# EAGLE design glove-unit (EAGLE 9.6.2)

## Sheet 1 of 2: ESP8266 LOLIN MCU
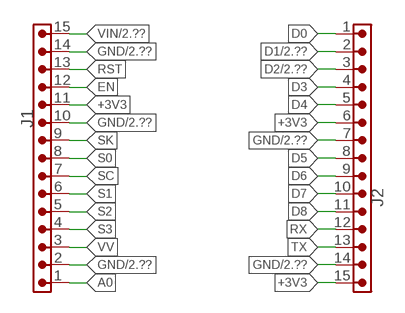
[diagram p0: schematic, sheet 1]

### Parts
J1  6130XX11121_61301511121  [61301511121]
J2  6130XX11121_61301511121  [61301511121]

### Nets
+3V3: J1.11 J2.6 J2.15 ; also sheet 2
A0: J1.1
D0: J2.1
D1: J2.2 ; also sheet 2
D2: J2.3 ; also sheet 2
D3: J2.4
D4: J2.5
D5: J2.8
D6: J2.9
D7: J2.10
D8: J2.11
EN: J1.12
GND: J1.2 J1.10 J1.14 J2.7 J2.14 ; also sheet 2
RST: J1.13
RX: J2.12
S0: J1.8
S1: J1.6
S2: J1.5
S3: J1.4
SC: J1.7
SK: J1.9
TX: J2.13
VIN: J1.15 ; also sheet 2
VV: J1.3

## Sheet 2 of 2: Connections
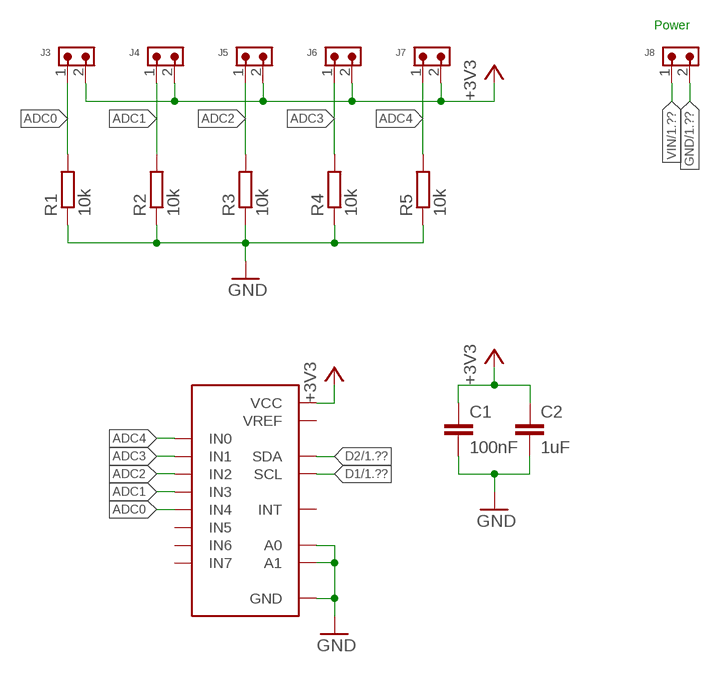
[diagram p1: schematic, sheet 2]

### Parts
C1  100nF  CC0603  [C0603]
C2  1uF  CC0603  [C0603]
J3  6130XX11121_61300211121  [61300211121]
J4  6130XX11121_61300211121  [61300211121]
J5  6130XX11121_61300211121  [61300211121]
J6  6130XX11121_61300211121  [61300211121]
J7  6130XX11121_61300211121  [61300211121]
J8  6130XX11121_61300211121  [61300211121]
R1  10k  R  [R0805]
R2  10k  R  [R0805]
R3  10k  R  [R0805]
R4  10k  R  [R0805]
R5  10k  R  [R0805]
U$1  ADC128D818  [TSSOP-16]

### Nets
+3V3: C1.1 C2.1 J3.2 J4.2 J5.2 J6.2 J7.2 U$1.5(VCC) ; also sheet 1
ADC0: J3.1 R1.2 U$1.12(IN4)
ADC1: J4.1 R2.2 U$1.13(IN3)
ADC2: J5.1 R3.2 U$1.14(IN2)
ADC3: J6.1 R4.2 U$1.15(IN1)
ADC4: J7.1 R5.2 U$1.16(IN0)
D1: U$1.3(SCL) ; also sheet 1
D2: U$1.2(SDA) ; also sheet 1
GND: C1.2 C2.2 J8.2 R1.1 R2.1 R3.1 R4.1 R5.1 U$1.4(GND) U$1.7(A0) U$1.8(A1) ; also sheet 1
VIN: J8.1 ; also sheet 1
Unconnected: U$1.1(VREF) U$1.6(INT) U$1.9(IN7) U$1.10(IN6) U$1.11(IN5)

### Notes on the sheet
- Power

## Library data of the parts
C1 C2 = ACS - Basics:C: CAPACITOR, European symbol; SPICEMODEL: NONE; SPICEPREFIX: C
J1 J2 = Wurth_Connectors_WR-PHD:6130XX11121_61301511121: WR-PHD 2.54 mm THT Pin Header ARTICLE PROPERTIES: Pins:1;​ 2;​ 3;​ 4;​ 5;​ 6;​ 7;​ 8;​ 9;​ 10;​ 12;​ 13;​ 14;​ 15;​ 16;​ 18;​ 20;​ 22;​ 24;​ 25;​ 32;​ 36;​ 40 KIND PROPERTIES: Pitch：2.54 mm Quality Class:3 as per CECC 75 301-802 Rows：Single Gender：Pin Header Type：Straight MATERIAL PROPERTIES: Insulator Material :PBT Insulator Flammability Rating:UL94 V-0 Contact Material:Copper Alloy Contact Plating:Gold Contact Type:Stamped GENERAL INFORMATION Operating Temperature:-40 up to +105 °C Compliance:RoHS ELECTRICAL PROPERTIES: Rated Current:3 A IR 1:3 A Withstanding Voltage:500 V (AC) Contact Resistance:20 mΩ RISO:1000 MΩ CERTIFICATION UL Approval:E323964 PACKAGING PROPERTIES Packaging:Bag <https://katalog.we-online.com/media/images/v2/o33211v209%20Family_BTB_PHD_6130xx11121.jpg> Details see: https://katalog.we-online.com/en/em/PHD_2_54_THT_PIN_HEADER_6130XX11121 Updated by Yingchun,Shan 2019-10-16 2019 (C) Würth Elektronik; DATASHEET-URL: https://katalog.we-online.com/em/datasheet/61301511121.pdf; GENDER: Pin Header; IR: 3A; MATES: WR-PHD 2.54mm Angled Socket Header /SMT Socket Header/Socket Header; PACKAGING: Bag; PART-NUMBER: 61301511121; PINS: 15; ROWS: Single; TYPE: Straight
J3-J8 = Wurth_Connectors_WR-PHD:6130XX11121_61300211121: WR-PHD 2.54 mm THT Pin Header ARTICLE PROPERTIES: Pins:1;​ 2;​ 3;​ 4;​ 5;​ 6;​ 7;​ 8;​ 9;​ 10;​ 12;​ 13;​ 14;​ 15;​ 16;​ 18;​ 20;​ 22;​ 24;​ 25;​ 32;​ 36;​ 40 KIND PROPERTIES: Pitch：2.54 mm Quality Class:3 as per CECC 75 301-802 Rows：Single Gender：Pin Header Type：Straight MATERIAL PROPERTIES: Insulator Material :PBT Insulator Flammability Rating:UL94 V-0 Contact Material:Copper Alloy Contact Plating:Gold Contact Type:Stamped GENERAL INFORMATION Operating Temperature:-40 up to +105 °C Compliance:RoHS ELECTRICAL PROPERTIES: Rated Current:3 A IR 1:3 A Withstanding Voltage:500 V (AC) Contact Resistance:20 mΩ RISO:1000 MΩ CERTIFICATION UL Approval:E323964 PACKAGING PROPERTIES Packaging:Bag <https://katalog.we-online.com/media/images/v2/o33211v209%20Family_BTB_PHD_6130xx11121.jpg> Details see: https://katalog.we-online.com/en/em/PHD_2_54_THT_PIN_HEADER_6130XX11121 Updated by Yingchun,Shan 2019-10-16 2019 (C) Würth Elektronik; DATASHEET-URL: https://katalog.we-online.com/em/datasheet/61300211121.pdf; GENDER: Pin Header; IR: 3A; MATES: WR-PHD 2.54mm Angled Socket Header /SMT Socket Header/Socket Header; PACKAGING: Bag; PART-NUMBER: 61300211121; PINS: 2; ROWS: Single; TYPE: Straight
R1-R5 = ACS - Basics:R: RESISTOR, European symbol; SPICEMODEL: NONE; SPICEPREFIX: R
U$1 = ACS - Chips:ADC128D818

## Board
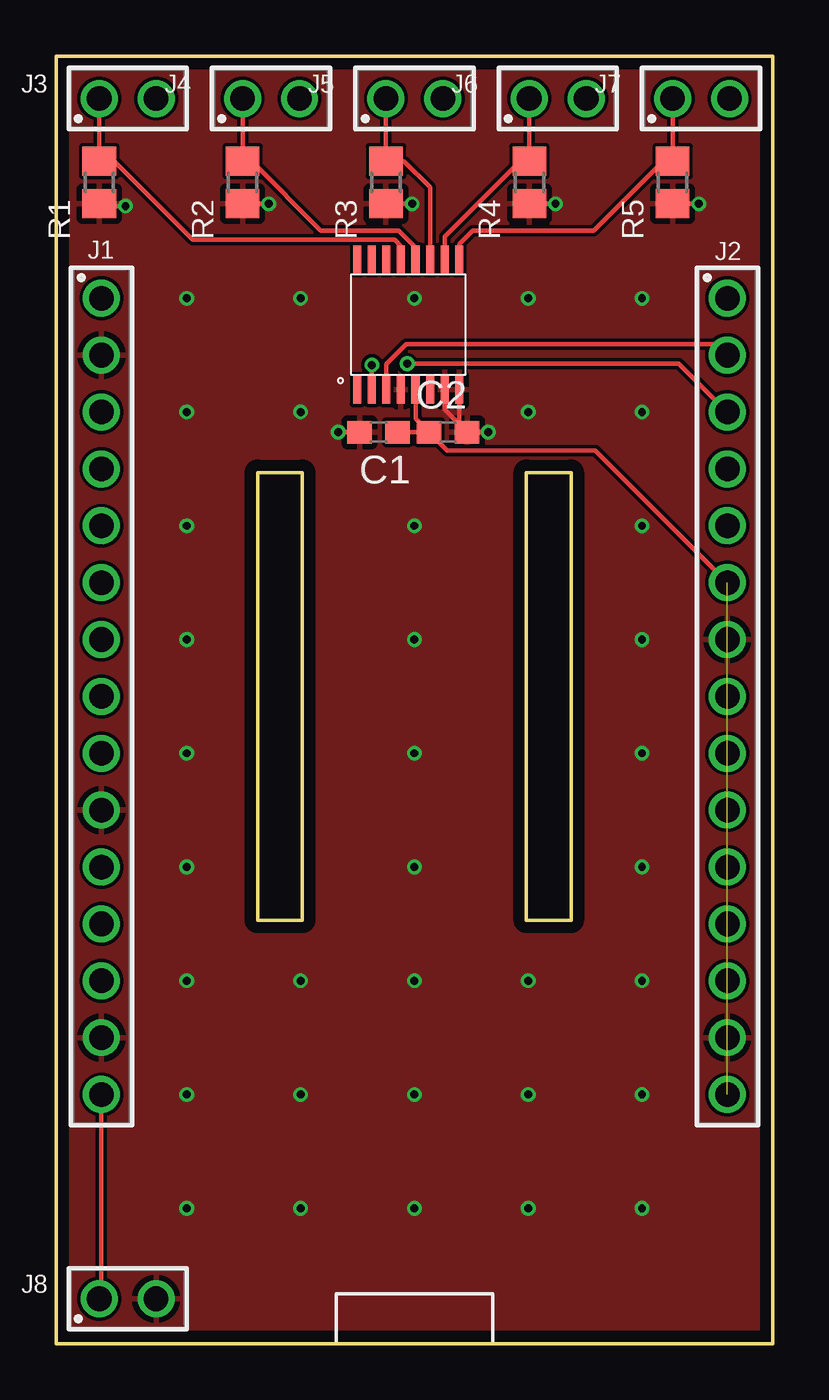
[diagram p2: board, top side]
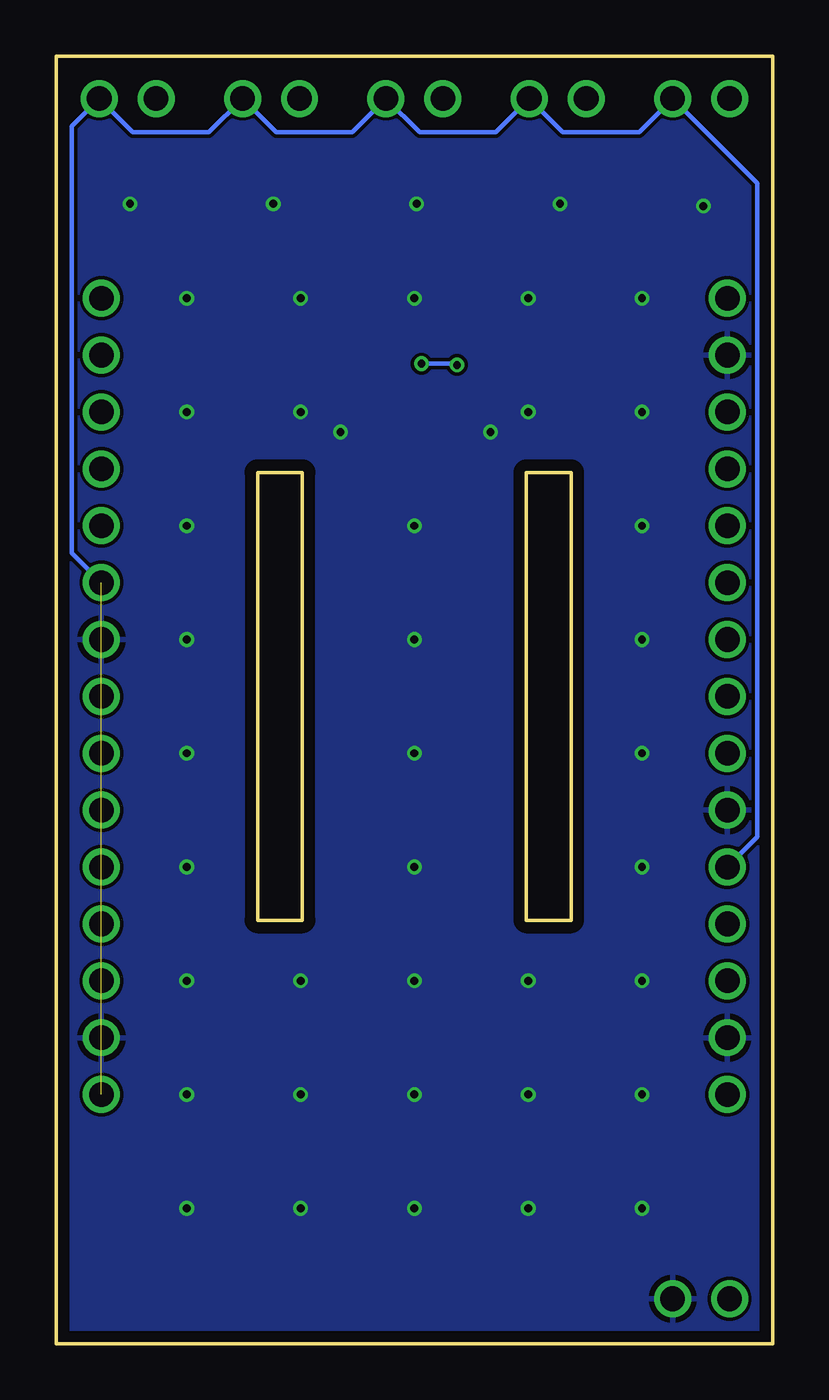
[diagram p3: board, bottom side, seen from below]

Size 32 x 57.5 mm. Coordinates in mm from the lower left corner, seen from the top.
Outline: 0,0 0,57.5 32,57.5 32,0 0,0
Outline: 9,18.9 9,38.9 11,38.9 11,18.9 9,18.9
Outline: 21,18.9 21,38.9 23,38.9 23,18.9 21,18.9
Copper layers (1*16): Top 0.035mm / dielectric 1.6mm / Bottom 0.035mm
Design rules "Elecrow_2-layer_PCB_eagle_rule": minimum track width 6mil, minimum drill 12mil, track to track 6mil, track to pad 6mil, pad to pad 6mil, via to via 8mil, smd to smd 0mil, copper to edge 20mil, drill to drill 10mil, minimum pad ring 6mil, minimum via ring 6mil, stop-mask expansion 0mil, vias tented up to drill 100mil, thermal gap 10mil

### Footprints (pad centres in the part's own frame; a part is rotated, then mirrored left to right if it is on the bottom)
C0603 = smd 1.1 x 1: 1 -0.85,0; 2 0.85,0
61301511121 = drill 1.1: 1 -17.78,0; 2 -15.24,0; 3 -12.7,0; 4 -10.16,0; 5 -7.62,0; 6 -5.08,0; 7 -2.54,0; 8 0,0; 9 2.54,0; 10 5.08,0; 11 7.62,0; 12 10.16,0; 13 12.7,0; 14 15.24,0; 15 17.78,0
61300211121 = drill 1.1: 1 -1.27,0; 2 1.27,0
R0805 = smd 1.3 x 1.5: 1 -0.95,0; 2 0.95,0
TSSOP-16 = smd 1.26 x 0.36: 1 0,4.55; 2 0,3.9; 3 0,3.25; 4 0,2.6; 5 0,1.95; 6 0,1.3; 7 0,0.65; 8 0,0; 9 5.8,4.55; 10 5.8,3.9; 11 5.8,3.25; 12 5.8,2.6; 13 5.8,1.95; 14 5.8,1.3; 15 5.8,0.65; 16 5.8,0

### Placement (x,y rotation side)
C1  14.4,40.7 180 top
C2  17.5,40.7 0 top
J1  2.03,28.9 270 top
J2  29.97,28.9 270 top
J3  3.2,55.6 0 top
J4  9.6,55.6 0 top
J5  16,55.6 0 top
J6  22.4,55.6 0 top
J7  28.8,55.6 0 top
J8  3.2,2 0 top
R1  1.93,51.85 90 top
R2  8.33,51.85 90 top
R3  14.73,51.85 90 top
R4  21.13,51.85 90 top
R5  27.53,51.85 90 top
U$1  18,42.6 90 top

### Tracks (layer width: path | path; a pad name or v marks a point on that pad's centre or on a via)
+3V3  (1 unrouted)
  Top 0.2: C2.1 C1.1 | C2.1 16.05,41.3 U$1.5 | C2.1 17.47,39.88 24.07,39.88 J2.6
  Bottom 0.2: J2.6 31.3,35.31 31.3,54.37 J7.2 28.57,54.1 25.17,54.1 J6.2 22.17,54.1 18.77,54.1 J5.2 15.77,54.1 12.37,54.1 J4.2 9.37,54.1 5.97,54.1 J3.2 0.68,51.81 0.68,22.63 J1.11
ADC0
  Top 0.2: J3.1 R1.2 2.6,52.8 6.1,49.3 15.12,49.3 15.4,49.02 U$1.12
ADC1
  Top 0.2: J4.1 R2.2 8.73,52.8 11.83,49.7 15.3,49.7 16.05,48.95 U$1.13
ADC2
  Top 0.2: J5.1 R3.2 15.53,52.8 16.7,51.63 U$1.14
ADC3
  Top 0.2: J6.1 R4.2 20.73,52.8 17.35,49.42 U$1.15
ADC4
  Top 0.2: J7.1 R5.2 27.1,52.8 24,49.7 18.6,49.7 18,49.1 U$1.16
D1
  Top 0.2: U$1.3 14.75,43.75 15.64,44.64 29.47,44.64 J2.2
D2  (via drill 0.35)
  Top 0.2: J2.3 27.81,43.76 v15.68,43.76 | v14.1,43.7 U$1.2
  Bottom 0.2: v15.68,43.76 14.16,43.76 v14.1,43.7
GND  (via drill 0.35)
  Top 0.2: R1.1 2.03,50.8 v3.1,50.8 | R2.1 v9.5,50.9 | R3.1 v15.9,50.9 | R4.1 v22.3,50.9 | R5.1 v28.7,50.9 | U$1.7 17.35,41.7 C2.2 | U$1.8 18,41.05 C2.2 | v19.3,40.7 C2.2 | C1.2 v12.6,40.7
  other vias: 5.84,46.68 5.84,41.6 5.84,36.52 5.84,31.44 5.84,26.36 5.84,21.28 5.84,16.2 5.84,11.12 5.84,6.04 10.92,6.04 10.92,11.12 10.92,16.2 16,16.2 21.08,16.2 26.16,16.2 26.16,11.12 26.16,6.04 21.08,6.04 21.08,11.12 16,11.12 16,6.04 16,21.28 16,26.36 16,31.44 16,36.52 26.16,31.44 26.16,26.36 26.16,21.28 26.16,36.52 26.16,41.6 21.08,41.6 10.92,41.6 10.92,46.68 16,46.68 21.08,46.68 26.16,46.68
  pour Top: -0.51,58.11 -0.51,-0.31 32.51,-0.31 32.51,58.11
  pour Bottom: -1.1,58.7 -1.1,-0.9 33.1,-0.9 33.1,58.7
VIN
  Top 0.2: J1.15 2.03,2.1 J8.1